# EAGLE design counter (EAGLE 9.6.2)
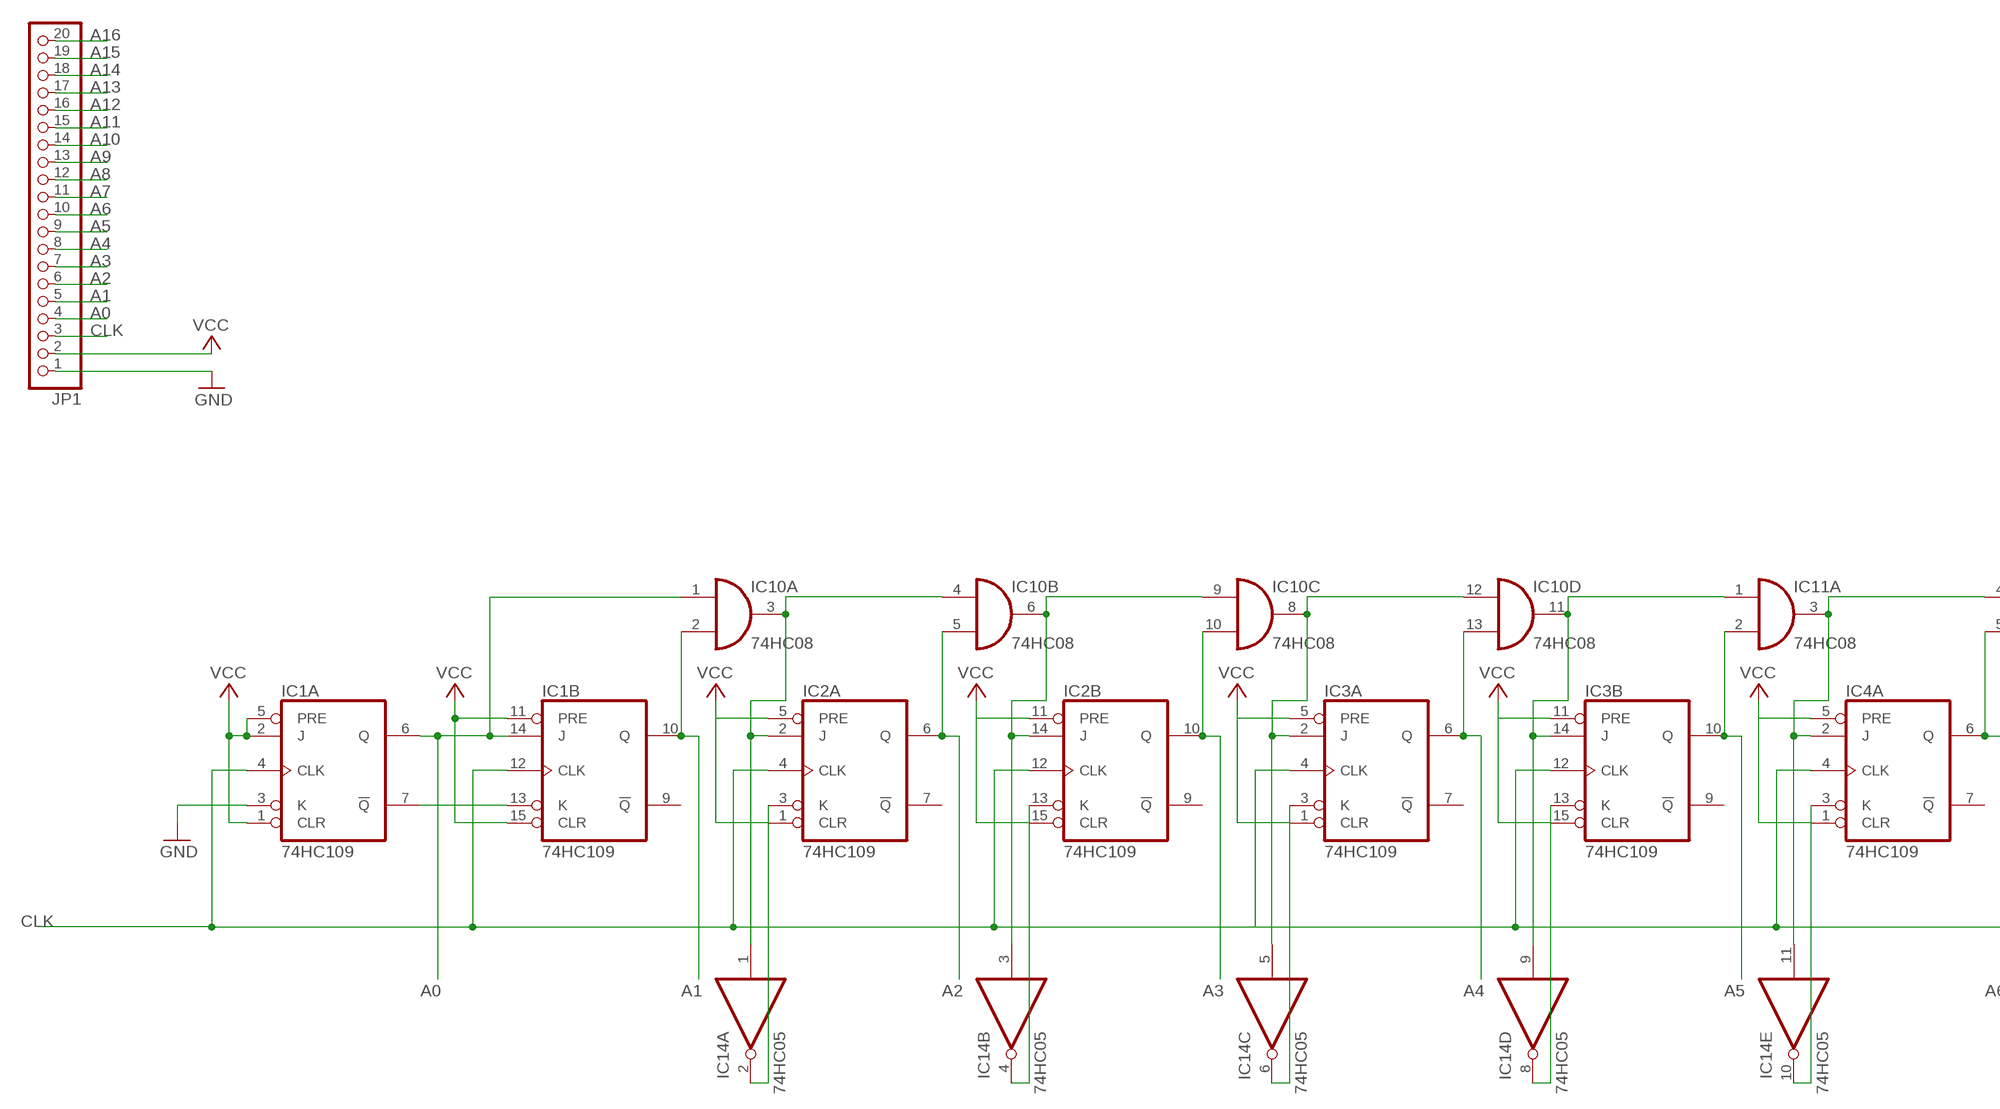
[diagram p0: schematic, sheet 1, part 1 of 2]
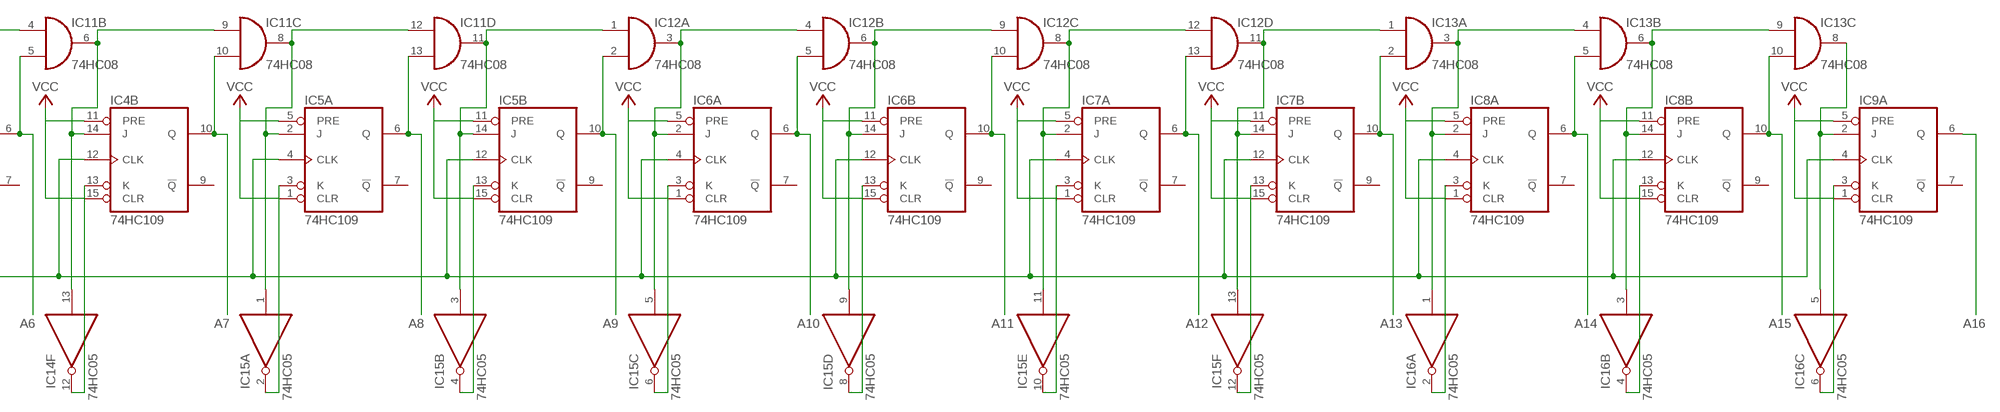
[diagram p1: schematic, sheet 1, part 2 of 2]

## Parts
IC1  74HC109  74HC109N  [DIL16]
IC2  74HC109  74HC109N  [DIL16]
IC3  74HC109  74HC109N  [DIL16]
IC4  74HC109  74HC109N  [DIL16]
IC5  74HC109  74HC109N  [DIL16]
IC6  74HC109  74HC109N  [DIL16]
IC7  74HC109  74HC109N  [DIL16]
IC8  74HC109  74HC109N  [DIL16]
IC9  74HC109  74HC109N  [DIL16]
IC10  74HC08  74AC08N  [DIL14]
IC11  74HC08  74AC08N  [DIL14]
IC12  74HC08  74AC08N  [DIL14]
IC13  74HC08  74AC08N  [DIL14]
IC14  74HC05  74ALS05N  [DIL14]
IC15  74HC05  74ALS05N  [DIL14]
IC16  74HC05  74ALS05N  [DIL14]
JP1  PINHD-1X20  [1X20]

## Nets
A0: IC1.6(A:Q) IC1.14(B:J) IC10.1(A:I0) JP1.4
A1: IC1.10(B:Q) IC10.2(A:I1) JP1.5
A2: IC2.6(A:Q) IC10.5(B:I1) JP1.6
A3: IC2.10(B:Q) IC10.10(C:I1) JP1.7
A4: IC3.6(A:Q) IC10.13(D:I1) JP1.8
A5: IC3.10(B:Q) IC11.2(A:I1) JP1.9
A6: IC4.6(A:Q) IC11.5(B:I1) JP1.10
A7: IC4.10(B:Q) IC11.10(C:I1) JP1.11
A8: IC5.6(A:Q) IC11.13(D:I1) JP1.12
A9: IC5.10(B:Q) IC12.2(A:I1) JP1.13
A10: IC6.6(A:Q) IC12.5(B:I1) JP1.14
A11: IC6.10(B:Q) IC12.10(C:I1) JP1.15
A12: IC7.6(A:Q) IC12.13(D:I1) JP1.16
A13: IC7.10(B:Q) IC13.2(A:I1) JP1.17
A14: IC8.6(A:Q) IC13.5(B:I1) JP1.18
A15: IC8.10(B:Q) IC13.10(C:I1) JP1.19
A16: IC9.6(A:Q) JP1.20
CLK: IC1.4(A:CLK) IC1.12(B:CLK) IC2.4(A:CLK) IC2.12(B:CLK) IC3.4(A:CLK) IC3.12(B:CLK) IC4.4(A:CLK) IC4.12(B:CLK) IC5.4(A:CLK) IC5.12(B:CLK) IC6.4(A:CLK) IC6.12(B:CLK) IC7.4(A:CLK) IC7.12(B:CLK) IC8.4(A:CLK) IC8.12(B:CLK) IC9.4(A:CLK) JP1.3
GND: IC1.3(A:K) JP1.1
N$1: IC1.7(A:!Q) IC1.13(B:K)
N$2: IC2.3(A:K) IC14.2(A:O)
N$3: IC2.13(B:K) IC14.4(B:O)
N$4: IC2.14(B:J) IC10.6(B:O) IC10.9(C:I0) IC14.3(B:I)
N$5: IC3.2(A:J) IC10.8(C:O) IC10.12(D:I0) IC14.5(C:I)
N$6: IC2.2(A:J) IC10.3(A:O) IC10.4(B:I0) IC14.1(A:I)
N$7: IC3.3(A:K) IC14.6(C:O)
N$8: IC3.13(B:K) IC14.8(D:O)
N$9: IC3.14(B:J) IC10.11(D:O) IC11.1(A:I0) IC14.9(D:I)
N$10: IC4.3(A:K) IC14.10(E:O)
N$11: IC4.14(B:J) IC11.6(B:O) IC11.9(C:I0) IC14.13(F:I)
N$12: IC5.2(A:J) IC11.8(C:O) IC11.12(D:I0) IC15.1(A:I)
N$13: IC4.13(B:K) IC14.12(F:O)
N$14: IC5.3(A:K) IC15.2(A:O)
N$15: IC5.13(B:K) IC15.4(B:O)
N$16: IC6.3(A:K) IC15.6(C:O)
N$17: IC6.13(B:K) IC15.8(D:O)
N$18: IC7.3(A:K) IC15.10(E:O)
N$19: IC7.13(B:K) IC15.12(F:O)
N$20: IC8.3(A:K) IC16.2(A:O)
N$21: IC8.13(B:K) IC16.4(B:O)
N$22: IC9.3(A:K) IC16.6(C:O)
N$24: IC4.2(A:J) IC11.3(A:O) IC11.4(B:I0) IC14.11(E:I)
N$25: IC5.14(B:J) IC11.11(D:O) IC12.1(A:I0) IC15.3(B:I)
N$26: IC6.2(A:J) IC12.3(A:O) IC12.4(B:I0) IC15.5(C:I)
N$27: IC6.14(B:J) IC12.6(B:O) IC12.9(C:I0) IC15.9(D:I)
N$28: IC7.2(A:J) IC12.8(C:O) IC12.12(D:I0) IC15.11(E:I)
N$29: IC7.14(B:J) IC12.11(D:O) IC13.1(A:I0) IC15.13(F:I)
N$30: IC8.2(A:J) IC13.3(A:O) IC13.4(B:I0) IC16.1(A:I)
N$31: IC8.14(B:J) IC13.6(B:O) IC13.9(C:I0) IC16.3(B:I)
N$35: IC9.2(A:J) IC13.8(C:O) IC16.5(C:I)
VCC: IC1.1(A:CLR) IC1.2(A:J) IC1.5(A:PRE) IC1.11(B:PRE) IC1.15(B:CLR) IC2.1(A:CLR) IC2.5(A:PRE) IC2.11(B:PRE) IC2.15(B:CLR) IC3.1(A:CLR) IC3.5(A:PRE) IC3.11(B:PRE) IC3.15(B:CLR) IC4.1(A:CLR) IC4.5(A:PRE) IC4.11(B:PRE) IC4.15(B:CLR) IC5.1(A:CLR) IC5.5(A:PRE) IC5.11(B:PRE) IC5.15(B:CLR) IC6.1(A:CLR) IC6.5(A:PRE) IC6.11(B:PRE) IC6.15(B:CLR) IC7.1(A:CLR) IC7.5(A:PRE) IC7.11(B:PRE) IC7.15(B:CLR) IC8.1(A:CLR) IC8.5(A:PRE) IC8.11(B:PRE) IC8.15(B:CLR) IC9.1(A:CLR) IC9.5(A:PRE) JP1.2
Unconnected: IC1.9(B:!Q) IC2.7(A:!Q) IC2.9(B:!Q) IC3.7(A:!Q) IC3.9(B:!Q) IC4.7(A:!Q) IC4.9(B:!Q) IC5.7(A:!Q) IC5.9(B:!Q) IC6.7(A:!Q) IC6.9(B:!Q) IC7.7(A:!Q) IC7.9(B:!Q) IC8.7(A:!Q) IC8.9(B:!Q) IC9.7(A:!Q) IC9.9(B:!Q) IC9.10(B:Q) IC9.11(B:PRE) IC9.12(B:CLK) IC9.13(B:K) IC9.14(B:J) IC9.15(B:CLR) IC13.11(D:O) IC13.12(D:I0) IC13.13(D:I1) IC16.8(D:O) IC16.9(D:I) IC16.10(E:O) IC16.11(E:I) IC16.12(F:O) IC16.13(F:I)

## Power pins joined to a net without a drawn wire
GND: IC1.8(P:GND) IC2.8(P:GND) IC3.8(P:GND) IC4.8(P:GND) IC5.8(P:GND) IC6.8(P:GND) IC7.8(P:GND) IC8.8(P:GND) IC9.8(P:GND) IC10.7(P:GND) IC11.7(P:GND) IC12.7(P:GND) IC13.7(P:GND) IC14.7(P:GND) IC15.7(P:GND) IC16.7(P:GND)
VCC: IC1.16(P:VCC) IC2.16(P:VCC) IC3.16(P:VCC) IC4.16(P:VCC) IC5.16(P:VCC) IC6.16(P:VCC) IC7.16(P:VCC) IC8.16(P:VCC) IC9.16(P:VCC) IC10.14(P:VCC) IC11.14(P:VCC) IC12.14(P:VCC) IC13.14(P:VCC) IC14.14(P:VCC) IC15.14(P:VCC) IC16.14(P:VCC)

## Library data of the parts
IC1-IC9 = 74xx-eu:74*109: Dual J-K positive edge triggered FLIP FLOP, preset and clear
IC10-IC13 = 74xx-eu:74*08: Quad 2-input AND gate
IC14-IC16 = 74xx-eu:74*05: Hex INVERTER, open collector
JP1 = adafruit:PINHD-1X20: PIN HEADER

## Board
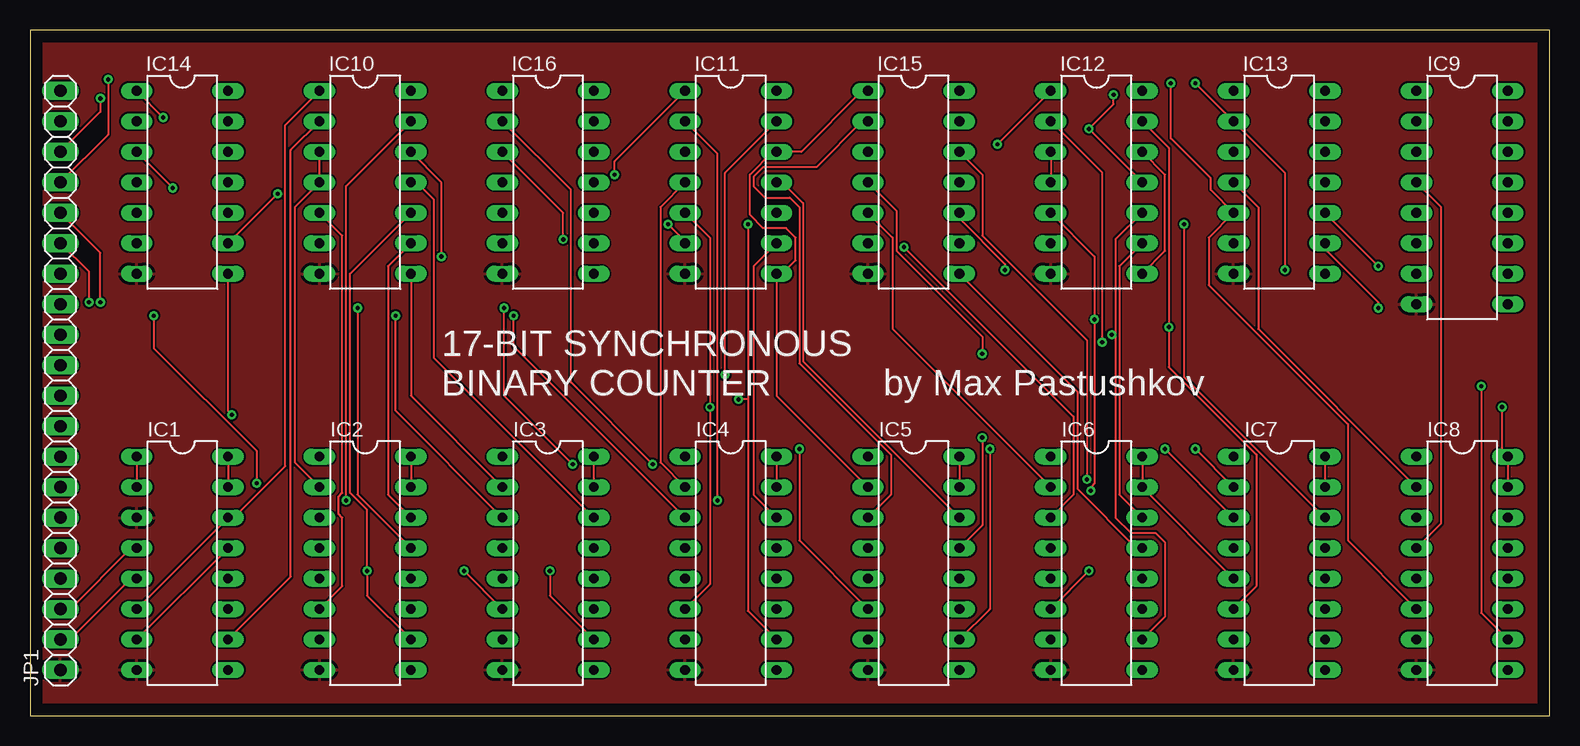
[diagram p2: board, top side]
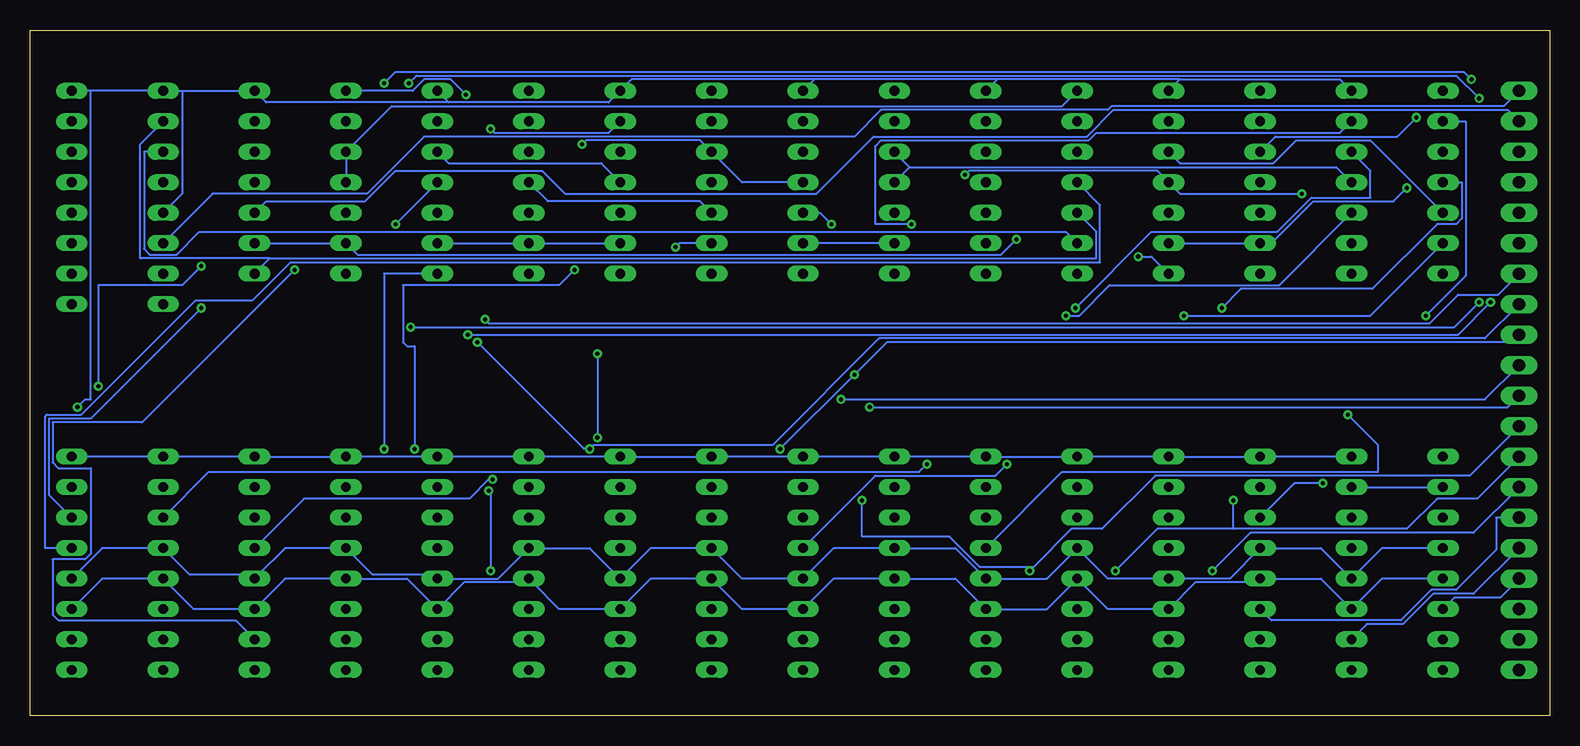
[diagram p3: board, bottom side, seen from below]

Size 126.67 x 57.14 mm. Coordinates in mm from the lower left corner, seen from the top.
Outline: 0,0 126.67,0 126.67,57.14 0,57.14 0,0
Copper layers (1*16): Top 0.035mm / dielectric 1.5mm / Bottom 0.035mm
Design rules "default": minimum track width 6mil, minimum drill 0.35mm, track to track 6mil, track to pad 6mil, pad to pad 6mil, via to via 6mil, smd to smd 6mil, copper to edge 40mil, drill to drill 6mil, minimum pad ring 10mil, minimum via ring 8mil, stop-mask expansion 4mil, vias tented up to drill 0mil, thermal gap 10mil

### Footprints (pad centres in the part's own frame; a part is rotated, then mirrored left to right if it is on the bottom)
DIL16 = drill 0.813 long: 1 -8.89,-3.81; 2 -6.35,-3.81; 3 -3.81,-3.81; 4 -1.27,-3.81; 5 1.27,-3.81; 6 3.81,-3.81; 7 6.35,-3.81; 8 8.89,-3.81; 9 8.89,3.81; 10 6.35,3.81; 11 3.81,3.81; 12 1.27,3.81; 13 -1.27,3.81; 14 -3.81,3.81; 15 -6.35,3.81; 16 -8.89,3.81
DIL14 = drill 0.813 long: 1 -7.62,-3.81; 2 -5.08,-3.81; 3 -2.54,-3.81; 4 0,-3.81; 5 2.54,-3.81; 6 5.08,-3.81; 7 7.62,-3.81; 8 7.62,3.81; 9 5.08,3.81; 10 2.54,3.81; 11 0,3.81; 12 -2.54,3.81; 13 -5.08,3.81; 14 -7.62,3.81
1X20 = drill 1.016 long: 1 -24.13,0; 2 -21.59,0; 3 -19.05,0; 4 -16.51,0; 5 -13.97,0; 6 -11.43,0; 7 -8.89,0; 8 -6.35,0; 9 -3.81,0; 10 -1.27,0; 11 1.27,0; 12 3.81,0; 13 6.35,0; 14 8.89,0; 15 11.43,0; 16 13.97,0; 17 16.51,0; 18 19.05,0; 19 21.59,0; 20 24.13,0

### Placement (x,y rotation side)
IC1  12.7,12.7 270 top
IC2  27.94,12.7 270 top
IC3  43.18,12.7 270 top
IC4  58.42,12.7 270 top
IC5  73.66,12.7 270 top
IC6  88.9,12.7 270 top
IC7  104.14,12.7 270 top
IC8  119.38,12.7 270 top
IC9  119.38,43.18 270 top
IC10  27.94,44.45 270 top
IC11  58.42,44.45 270 top
IC12  88.9,44.45 270 top
IC13  104.14,44.45 270 top
IC14  12.7,44.45 270 top
IC15  73.66,44.45 270 top
IC16  43.18,44.45 270 top
JP1  2.54,27.94 90 top

### Tracks (layer width: path | path; a pad name or v marks a point on that pad's centre or on a via)
A0
  Top 0.152: IC1.6 IC1.14 16.99,16.51 21.27,20.8 21.27,49.21 IC10.1
  Bottom 0.152: IC1.6 7.94,9.84 4.13,9.84 JP1.4
A1
  Top 0.152: IC10.2 21.75,47.15 21.75,11.59 IC1.10
  Bottom 0.152: IC1.10 15.24,7.62 12.22,7.62 9.68,10.16 6.35,10.16 JP1.5
A2
  Top 0.152: IC10.5 26.04,40.01 26.04,18.57 25.72,18.26 25.72,16.83 26.04,16.51 26.04,10.79 IC2.6
  Bottom 0.152: IC2.6 23.18,7.94 12.38,7.94 9.84,10.48 7.78,10.48 4.45,13.81 4.45,16.51 JP1.6
A3  (via drill 0.35)
  Top 0.152: IC2.10 28.1,10 v28.1,12.06 28.1,17.14 26.67,18.57 26.67,36.83 IC10.10
  Bottom 0.152: v28.1,12.06 24.92,15.24 6.35,15.24 JP1.7
A4  (via drill 0.35)
  Top 0.152: v36.2,12.06 IC3.6 | IC10.13 26.35,44.13 v26.35,17.94
  Bottom 0.152: v36.2,12.06 32.7,15.56 26.35,15.56 | 26.35,15.56 11.91,15.56 9.37,18.1 6.03,18.1 JP1.8 | 26.35,15.56 v26.35,17.94
A5  (via drill 0.35)
  Top 0.152: IC3.10 43.34,10 v43.34,12.06 | IC11.2 57.31,46.83 v57.31,17.94
  Bottom 0.152: 43.02,12.38 39.85,15.56 37.31,15.56 32.86,20 6.67,20 JP1.9 | 43.02,12.38 v43.34,12.06 | v57.31,17.94 57.31,14.92 50.01,14.92 47.47,12.38 43.02,12.38
A6  (via drill 0.35)
  Top 0.152: IC4.6 56.67,10.95 v56.67,25.72 56.67,39.85 IC11.5
  Bottom 0.152: JP1.10 3.49,25.72 v56.67,25.72
A7  (via drill 0.35)
  Top 0.152: IC4.10 59.85,8.73 59.85,26.35 | v59.85,40.96 59.85,26.35 | 59.85,26.35 v59.05,26.35
  Bottom 0.152: v59.85,40.96 60.8,41.91 IC11.10 | JP1.11 5.4,26.35 v59.05,26.35
A8  (via drill 0.35)
  Top 0.152: IC5.6 64.14,14.61 v64.14,22.23 | IC11.13 57.94,45.24 v57.94,28.42
  Bottom 0.152: v64.14,22.23 v57.94,28.42 55.24,31.11 3.17,31.11 JP1.12
A9  (via drill 0.35)
  Top 0.152: IC5.10 80.01,8.89 v80.01,22.23 | IC12.2 89.38,45.24 v89.38,31.11
  Bottom 0.152: JP1.13 5.4,31.43 55.88,31.43 64.77,22.54 79.69,22.54 v80.01,22.23 80.49,22.23 v89.38,31.11
A10  (via drill 0.35)
  Top 0.152: v88.27,12.06 IC6.6 | v88.42,18.73 88.42,19.05 88.74,19.37 v88.74,33.02 88.74,38.26 IC12.5
  Bottom 0.152: v88.27,12.06 88.27,18.73 v88.42,18.73 | JP1.14 4.29,35.08 7.62,35.08 10,32.7 88.42,32.7 v88.74,33.02
A11  (via drill 0.35)
  Top 0.152: IC6.10 94.61,8.26 94.61,14.45 93.82,15.24 91.76,15.24 90.49,16.51 90.49,31.75 | 90.49,31.75 90.49,39.69 IC12.10 | JP1.15 4.92,36.99 v4.92,34.45 | 90.49,31.75 v90.17,31.75
  Bottom 0.152: v4.92,34.45 7.62,31.75 v90.17,31.75
A12  (via drill 0.35)
  Top 0.152: IC7.6 102.23,10.79 102.23,21.75 94.93,29.05 v94.93,32.38 94.93,47.31 IC12.13 | JP1.16 5.87,38.58 v5.87,34.45
  Bottom 0.152: v5.87,34.45 7.94,32.38 v94.93,32.38
A13  (via drill 0.35)
  Top 0.152: v104.62,37.15 104.62,45.24 IC13.2 v97.16,52.7 | JP1.17 6.51,48.42 v6.51,53.02
  Bottom 0.152: IC7.10 109.54,7.94 124.3,7.94 124.78,8.41 124.78,13.02 122.08,13.02 121.6,13.49 121.6,20.64 124.3,20.64 124.78,21.11 124.78,24.45 117.32,24.45 v104.62,37.15 | v6.51,53.02 7.14,53.66 96.2,53.66 v97.16,52.7
A14  (via drill 0.35)
  Top 0.152: IC8.6 109.86,14.61 109.86,24.29 98.27,35.88 98.27,39.85 IC13.5 98.42,43.81 98.42,44.77 95.09,48.1 v95.09,52.7 | JP1.18 5.87,50.32 v5.87,51.44
  Bottom 0.152: v5.87,51.44 7.78,53.34 94.46,53.34 v95.09,52.7
A15  (via drill 0.35)
  Top 0.152: IC8.10 120.97,8.57 v120.97,27.46 | IC13.10 v112.39,37.47
  Bottom 0.152: v120.97,27.46 120.97,35.88 113.98,35.88 v112.39,37.47 | JP1.19 3.49,50.48 36.35,50.48 38.58,48.26 56.36,48.26 61.12,43.5 82.07,43.5 83.98,45.4 96.2,45.4 98.74,42.86 107,42.86 IC13.10
A16
  Bottom 0.152: IC9.6 111.44,43.5 98.58,43.5 93.82,48.26 57.94,48.26 55.72,50.48 36.83,50.48 36.51,50.8 3.81,50.8 JP1.20
CLK
  Top 0.152: IC9.4 117.63,42.39 117.63,16.03 IC8.4 | JP1.3 3.33,8.89 8.41,13.97 IC1.4
  Bottom 0.152: 107.63,11.75 105.41,13.97 IC7.4 98.11,11.75 93.03,11.75 IC6.12 87.63,11.43 IC6.4 80.01,13.97 IC5.12 74.93,13.97 IC5.4 67.31,11.43 IC4.12 59.69,13.97 IC4.4 49.53,13.97 IC3.12 41.91,11.43 IC3.4 36.83,11.43 IC2.12 26.67,11.43 IC2.4 19.05,13.97 IC1.12 13.97,13.97 IC1.4 | 107.63,11.75 113.35,11.75 IC8.4 120.65,13.97 IC8.12 | 107.63,11.75 IC7.12
GND
  pour Top: -2.54,59.69 -2.54,-2.54 129.54,-2.54 129.54,59.69
N$1
  Top 0.152: IC1.13 IC1.7
N$2  (via drill 0.35)
  Top 0.152: v18.89,19.37 18.89,22.07 10.32,30.64 v10.32,33.34
  Bottom 0.152: IC2.3 21.27,19.37 v18.89,19.37 | v10.32,33.34 6.99,36.67 6.99,49.53 IC14.2
N$3  (via drill 0.35)
  Top 0.152: IC2.13 27.3,18.41 v27.3,33.97
  Bottom 0.152: v27.3,33.97 25.72,35.56 14.76,35.56 9.37,40.96 7.78,40.96 7.3,41.43 7.3,44.45 IC14.4
N$4  (via drill 0.35)
  Top 0.152: IC2.14 29.84,18.41 29.84,37.47 IC10.9 | v11.91,43.97 IC14.3
  Bottom 0.152: IC10.9 IC10.6 23.18,39.37 19.68,42.86 13.02,42.86 v11.91,43.97
N$5  (via drill 0.35)
  Top 0.152: v34.29,38.26 34.29,44.45 IC10.12 | IC3.2 31.75,26.67 IC10.8
  Bottom 0.152: IC14.5 14.92,47.94 21.11,47.94 23.02,46.04 30.8,46.04 IC10.12 | IC10.8 33.18,38.26 v34.29,38.26
N$6  (via drill 0.35)
  Top 0.152: IC2.2 22.07,21.11 22.07,42.39 IC10.4 IC10.3 | v11.11,49.85 IC14.1
  Bottom 0.152: v11.11,49.85 12.7,48.26 22.86,48.26 IC10.3
N$7  (via drill 0.35)
  Top 0.152: v30.48,33.34 30.48,25.4 IC3.3
  Bottom 0.152: IC14.6 14.92,33.34 v30.48,33.34
N$8  (via drill 0.35)
  Top 0.152: IC14.8 16.51,25.4 v16.83,25.08
  Bottom 0.152: v16.83,25.08 14.29,22.54 14.29,20.32 40.64,20.32 IC3.13
N$9  (via drill 0.35)
  Top 0.152: v20.64,43.5 IC14.9 | IC3.14 33.66,29.84 33.66,43.02 32.23,44.45 IC10.11 | IC11.1 48.74,46.2 v48.74,45.09
  Bottom 0.152: v20.64,43.5 30.8,43.5 IC10.11 32.7,45.4 48.42,45.4 v48.74,45.09
N$10  (via drill 0.35)
  Top 0.152: v40.32,33.34 40.32,30.8 IC4.3
  Bottom 0.152: IC14.10 22.54,35.88 36.67,35.88 39.21,33.34 v40.32,33.34
N$11  (via drill 0.35)
  Top 0.152: IC4.14 60.33,18.41 60.33,37.47 IC11.9 | v53.18,40.96 54.61,39.53 IC11.6
  Bottom 0.152: IC14.13 17.46,48.58 37.78,48.58 38.42,47.94 55.72,47.94 56.2,47.47 56.2,40.96 v53.18,40.96 | IC11.6 IC11.9
N$12
  Top 0.152: IC15.1 69.37,52.07 64.29,46.99 IC11.12 61.91,46.99 60.01,45.09 60.01,41.75 61.12,40.64 63.02,40.64 63.82,39.85 63.82,37.94 62.23,36.35 | IC5.2 62.23,26.67 62.23,36.35 | 62.23,36.35 IC11.8
N$13  (via drill 0.35)
  Top 0.152: v39.53,33.97 39.53,26.67 v45.24,20.95
  Bottom 0.152: IC14.12 14.92,45.4 14.92,43.18 19.84,43.18 22.7,40.32 33.18,40.32 v39.53,33.97 | v45.24,20.95 46.2,20 56.2,20 IC4.13
N$14
  Top 0.152: IC5.3 71.75,18.41 71.75,21.75 64.14,29.37 64.14,42.39 63.34,43.18 61.28,43.18 60.33,44.13 60.33,44.93 61.12,45.72 65.56,45.72 69.37,49.53 IC15.2
N$15  (via drill 0.35)
  Top 0.152: IC5.13 79.38,15.88 v79.38,23.18 | v79.38,30.16 79.38,31.59 72.23,38.73 72.23,42.07 IC15.4
  Bottom 0.152: v79.38,30.16 v79.38,23.18
N$16  (via drill 0.35)
  Top 0.152: IC6.3 87,18.41 87,24.92 v72.87,39.05
  Bottom 0.152: v72.87,39.05 72.55,39.37 IC15.6
N$17
  Top 0.152: IC6.13 92.23,13.97 87.31,18.89 87.31,26.99 IC15.8
N$18  (via drill 0.35)
  Top 0.152: v94.61,22.23 IC7.3 | v81.28,37.15 81.28,37.62 77.47,41.43 IC15.10
  Bottom 0.152: v94.61,22.23 94.61,30.8 95.25,30.8 95.57,31.11 95.57,35.88 82.55,35.88 v81.28,37.15
N$19  (via drill 0.35)
  Top 0.152: v88.11,19.68 88.11,31.27 79.38,40.01 79.38,45.09 IC15.12
  Bottom 0.152: IC7.13 103.82,18.1 90.01,18.1 88.42,19.68 v88.11,19.68
N$20  (via drill 0.35)
  Top 0.152: IC16.2 45.09,43.81 45.09,27.78 v51.91,20.95
  Bottom 0.152: v51.91,20.95 52.55,20.32 111.76,20.32 IC8.3
N$21
  Bottom 0.152: IC16.4 37.47,42.55 37.47,37.78 104.93,37.78 108.11,34.61 112.87,34.61 122.4,25.08 125.25,25.08 125.41,24.92 125.41,13.97 IC8.13
N$22
  Bottom 0.152: IC16.6 40.32,40.32 112.55,40.32 114.46,38.42 116.68,38.42 117.16,38.89 117.16,46.99 IC9.3
N$24
  Top 0.152: IC4.2 52.55,21.11 52.55,42.39 IC11.4
  Bottom 0.152: IC14.11 17.78,45.72 53.34,45.72 | IC11.3 53.34,45.72 | 53.34,45.72 IC11.4
N$25  (via drill 0.35)
  Top 0.152: IC5.14 64.45,29.53 64.45,42.7 62.71,44.45 IC11.11 | v80.64,47.62 IC12.1
  Bottom 0.152: IC11.11 67.31,44.45 IC15.3 70.8,47.94 80.33,47.94 v80.64,47.62
N$26
  Top 0.152: IC12.3 IC12.4 | IC6.2 71.91,32.23 71.91,39.85 IC15.5
  Bottom 0.152: IC12.4 83.5,42.86 70.8,42.86 IC15.5
N$27
  Top 0.152: IC6.14 90.81,18.41 90.81,37.47 IC12.9
  Bottom 0.152: IC15.9 IC12.6 IC12.9
N$28  (via drill 0.35)
  Top 0.152: v97.16,22.23 IC7.2 | IC12.12 94.61,45.09 94.61,38.73 IC12.8
  Bottom 0.152: IC15.11 79.06,46.04 91.76,46.04 IC12.12 | v97.16,22.23 97.16,36.83 IC12.8
N$29  (via drill 0.35)
  Top 0.152: IC7.14 96.2,28.26 v96.2,40.96 | IC12.11 v88.27,48.9 90.33,50.96 v90.33,51.75
  Bottom 0.152: IC12.11 v96.2,40.96 | IC15.13 78.42,48.58 87.95,48.58 v88.27,48.9 | IC13.1 94.77,52.07 93.82,53.02 91.6,53.02 v90.33,51.75
N$30
  Top 0.152: IC8.2 102.39,32.23 102.39,42.39 IC13.4
  Bottom 0.152: IC16.1 40.64,50.8 96.52,50.8 IC13.3 IC13.4
N$31  (via drill 0.35)
  Top 0.152: IC16.3 44.45,41.91 v44.45,39.69 | v112.39,33.97 112.39,34.45 107.95,38.89 IC13.9
  Bottom 0.152: IC13.9 IC13.6 99.38,38.42 45.72,38.42 v44.45,39.69 | IC8.14 125.09,18.41 125.09,24.77 121.6,24.77 v112.39,33.97
N$35
  Bottom 0.152: IC16.5 37.78,40.32 37.78,38.1 106.68,38.1 | IC13.8 106.68,38.1 | IC9.2 117.47,47.62 117.47,38.1 106.68,38.1
VCC  (via drill 0.35)
  Top 0.152: IC6.16 IC6.15 IC7.5 | IC8.15 IC8.16 122.71,22.07 v122.71,25.72 | IC7.16 IC7.15 | IC4.16 IC4.15 | IC5.16 IC5.15 | IC1.1 IC1.2 | IC1.16 IC1.15 | IC2.16 IC2.15 | IC3.16 IC3.15 | JP1.2 3.33,6.35 8.41,11.43 IC1.5
  Bottom 0.152: IC9.5 113.98,43.5 113.98,52.07 | 113.98,52.07 IC9.1 121.6,52.07 | 113.98,52.07 IC13.14 107,51.12 91.76,51.12 | 121.6,52.07 IC9.16 | IC14.14 17.46,53.02 30.8,53.02 | IC10.14 30.8,53.02 | 46.04,53.02 IC16.14 | 30.8,53.02 46.04,53.02 | 61.28,53.02 IC11.14 | 46.04,53.02 61.28,53.02 | 61.28,53.02 76.52,53.02 IC15.14 78.42,51.12 91.76,51.12 | 91.76,51.12 IC12.14 | IC8.16 IC8.1 IC7.16 IC7.1 IC6.16 IC6.1 IC5.16 IC5.1 IC4.16 IC4.1 IC3.16 IC3.1 IC2.16 IC2.1 IC1.16 | IC1.15 IC1.2 | IC8.11 120.65,11.43 IC8.5 113.03,8.89 IC7.11 105.41,11.43 IC7.5 95.25,11.43 IC6.11 90.49,11.11 84.77,11.11 | IC1.5 13.97,11.43 IC1.11 19.05,11.43 IC2.5 24.45,11.11 29.53,11.11 IC2.11 36.83,8.89 IC3.5 41.91,8.89 IC3.11 49.53,11.43 IC4.5 59.69,11.43 IC4.11 67.31,8.89 IC5.5 74.93,11.43 IC5.11 82.55,8.89 84.77,11.11 | 84.77,11.11 IC6.5 | 121.6,52.07 121.6,26.35 122.08,26.35 v122.71,25.72

### Text on the board
tPlace: 17-BIT SYNCHRONOUS / BINARY COUNTER | by Max Pastushkov